# EAGLE schematic SPDTrelay_w_diodes (EAGLE 8.7.0)
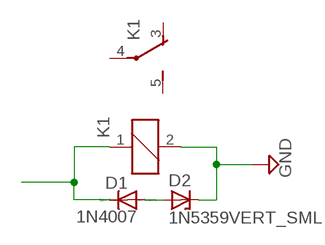
[diagram p0: schematic, sheet 1]

## Parts
D1  1N4007  [RAD2,5]
D2  1N5359VERT_SML  [RAD2.5_D2]
K1  HF41F-12-Z  [HF41F-12-Z]

## Nets
D$1: D1.A D2.A
GND: D2.C K1.2
IN: D1.C K1.1
Unconnected: K1.3(2:O) K1.4(2:P) K1.5(2:S)

## Library data of the parts
D1 = relay_computer_custom:1N4007: DIODE general purpose rectifier, 1 A
D2 = relay_computer_custom:1N5359: Z DIODE 24 V, 5W
K1 = relay_computer_custom:HF41F-12-Z: SPDT RELAY Relay SPDT 5mm x 28mm HONGFA